# EasyEDA Pro project 单相逆变离并网和整流拓扑.epro, board PCB2
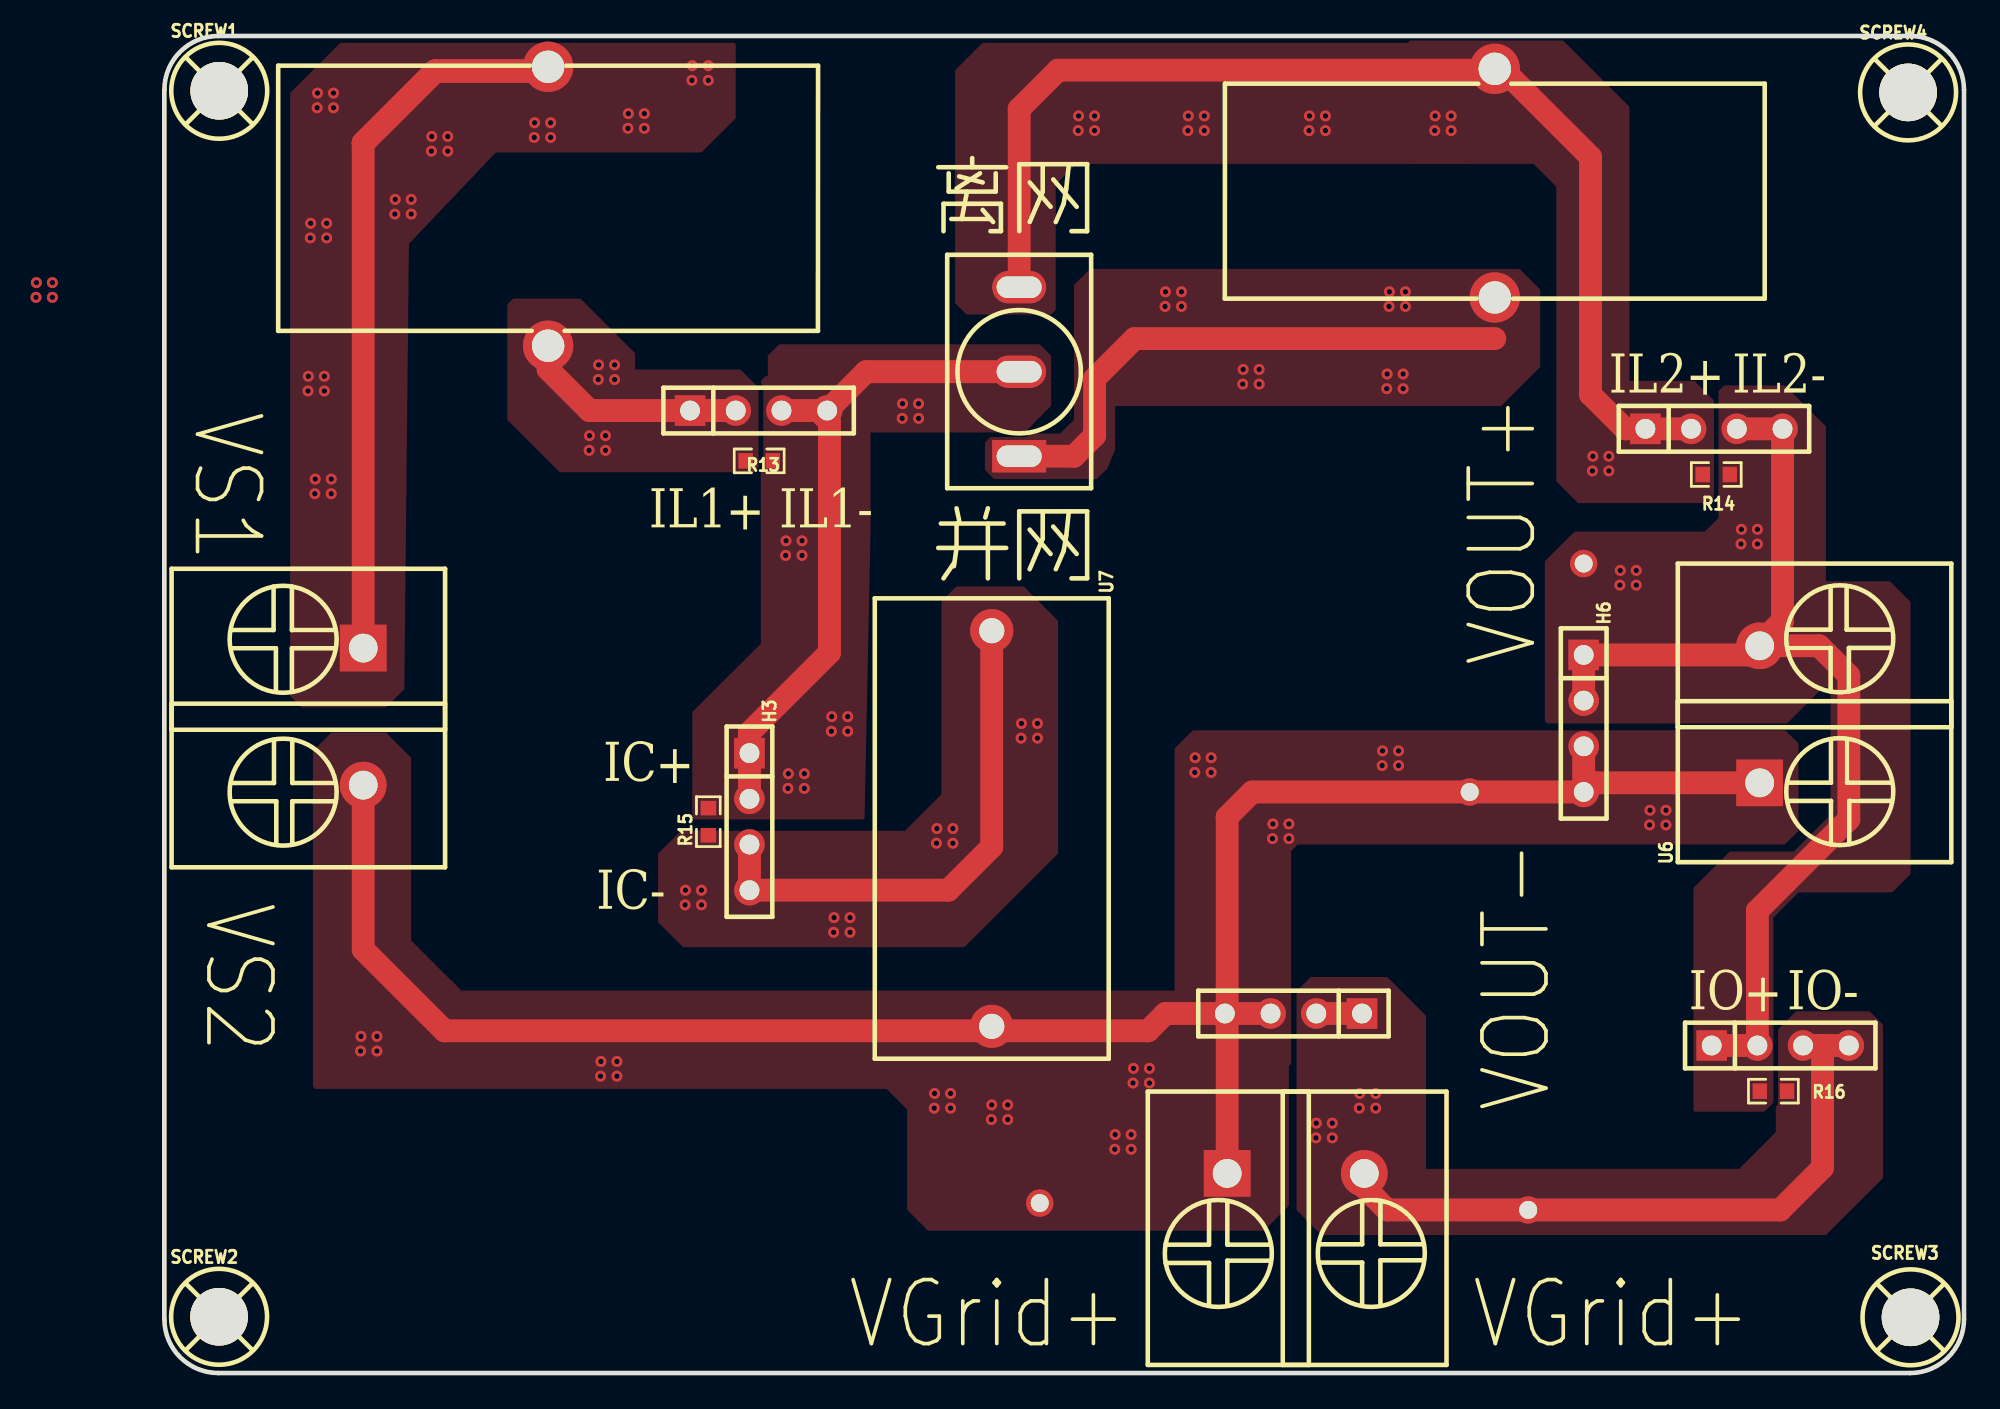
[diagram p2: board, top side]
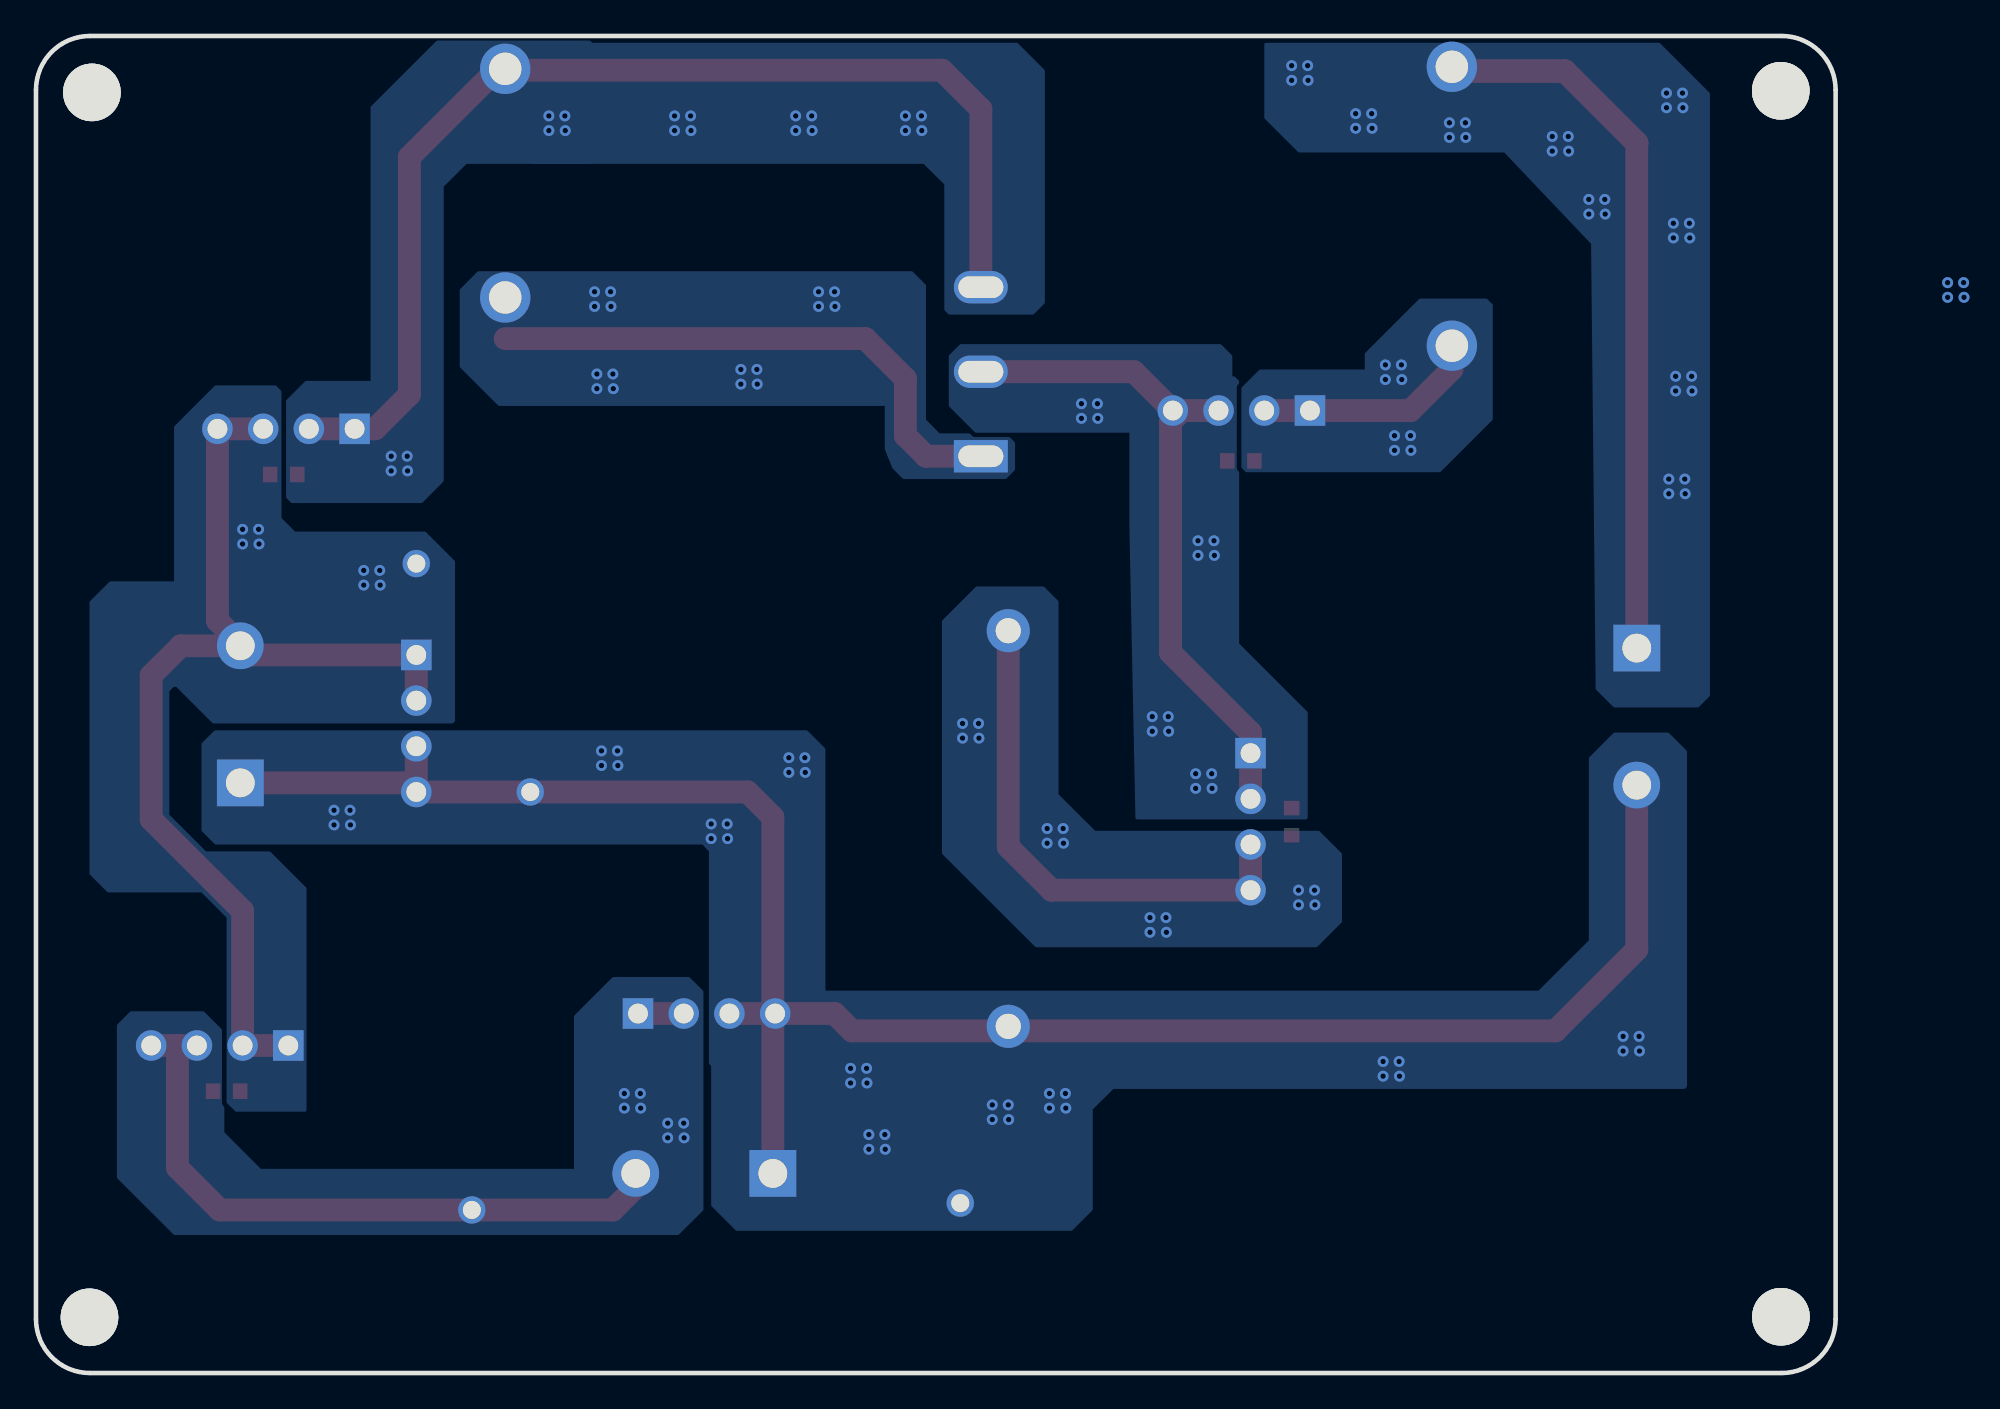
[diagram p3: board, bottom side, seen from below]

Outline 100 x 74.35 mm; copper layers: Top Layer, Bottom Layer. Coordinates in mm from the lower left corner of the outline.
Outline path: 0,71.35 0,3 arc(0.88,0.88) 3,0 97,0 arc(99.12,0.88) 100,3 100,71.35 arc(99.12,73.47) 97,74.35 3,74.35 arc(0.88,73.47) 0,71.35
Stack: Top Layer 0.035mm / Dielectric1 1.51mm FR4 er 4.5 / Bottom Layer 0.035mm

## Design rules (mm)
template: 自定义配置
spacing copperThickness1oz (default): track to track 0.102, other pairs 0.152 to 0.3
spacing copperThickness2oz: track to track 0.203, other pairs 0.152 to 0.3
track width copperThickness1oz (default): min 0.127, default 0.254, max 2.54
track width copperThickness2oz: min 0.203, default 0.254, max 2.54
differential pair differentialPair (default): width min 0.127, default 0.254, max 2.54; gap min 0.152, default 0.152
via viaSize (default): diameter min 0.5, default 0.61, max 10; hole min 0.3, default 0.305, max 6.3

## Placement (name value [footprint] x y rotation side)
H2  逆变侧电流检测  [HDR-TH_4P-P2.54-V-F]  33.02 53.52 0 top
H3  电容电流检测  [HDR-TH_4P-P2.54-V-F]  32.51 30.66 270 top
H4  网侧电流检测  [HDR-TH_4P-P2.54-V-F]  86.11 52.5 0 top
H5  继电器  [HDR-TH_4P-P2.54-V-F]  89.79 18.21 0 top
H6  逆变电压检测  [HDR-TH_4P-P2.54-V-F]  78.87 36.12 270 top
H7  电网电压检测  [HDR-TH_4P-P2.54-V-F]  62.74 19.99 180 top
L1  1.2mH  [直插环形电感]  23.37 65.58 270 top
L2  1.2mH  [直插环形电感#2]  71.88 64.06 90 top
NOREF  -  [Pad_e97]  75.78 9.07 0 top
NOREF#2  -  [Pad_e85]  78.87 45.01 0 top
NOREF#3  -  [Pad_e104]  48.64 9.45 0 top
NOREF#4  -  [Pad_e87]  72.53 32.31 0 top
R13  10Ω  [R0603]  33.05 50.72 0 top
R14  10Ω  [R0603]  86.23 49.96 0 top
R15  10Ω  [R0603]  30.23 30.66 90 top
R16  10Ω  [R0603]  89.41 15.67 0 top
SCREW1  -  [M3螺丝]  3.05 71.3 0 top
SCREW2  -  [M3螺丝]  3.04 3.13 0 top
SCREW3  -  [M3螺丝]  97.03 3.1 0 top
SCREW4  -  [M3螺丝]  96.89 71.21 0 top
U5  桥臂输出  [CONN-TH_2P-P7.62_L15.2-W16.7-EX4.2]  11.05 36.5 270 top
U6  桥臂输出  [CONN-TH_2P-P7.62_L15.2-W16.7-EX4.2]  88.65 36.63 90 top
U7  10uF  [CAP-TH_L25.5-W13.0-P22.50-D1.4]  45.97 30.28 270 top
U9  MT-0-102-A101-M200-RS  [SW-TH_MT-0-103-A101-M200-RS]  47.5 55.68 90 top
U10  桥臂输出  [CONN-TH_2P-P7.62_L15.2-W16.7-EX4.2]  62.86 11.1 0 top

## Footprints (pads in the part's own frame, mm; a bottom-side part is the same pattern mirrored in y, then rotated)
CAP-TH_L25.5-W13.0-P22.50-D1.4
  round 2.4 hole 1.4: 1(-11,0) 2(11,0)
CONN-TH_2P-P7.62_L15.2-W16.7-EX4.2
  rect 2.6x2.6 hole 1.6: 1(-3.81,0)
  round 2.6 hole 1.6: 2(3.81,0)
HDR-TH_4P-P2.54-V-F
  rect 1.7x1.7 hole 1.1: 1(-3.81,0)
  round 1.7 hole 1.1: 2(-1.27,0) 3(1.27,0) 4(3.81,0)
M3螺丝
  round 3.2 hole 3.2: 1(0,0)
Pad_e85
  round 1.524 hole 1: 1(0,0)
Pad_e87
  round 1.524 hole 1: 1(0,0)
Pad_e97
  round 1.524 hole 1: 1(0,0)
Pad_e104
  round 1.524 hole 1: 2(0,0)
R0603
  rect 0.806x0.864 smd: 1(-0.753,0) 2(0.753,0)
SW-TH_MT-0-103-A101-M200-RS
  rect 1.8x3 hole 1.2x2.5: 1(-4.7,0)
  oval 1.8x3 hole 1.2x2.5: 2(0,0) 3(4.7,0)
直插环形电感
  round 2.8 hole 1.8: 1(-7.048,-2.045) 2(8.46,-2.045)
直插环形电感#2
  round 2.8 hole 1.8: 1(-4.254,-2.045) 2(8.46,-2.045)

## Nets
IC+: H2.3 H2.4 H3.1 H3.2 R13.2 R15.2 U9.2
IC-: H3.3 H3.4 R15.1 U7.1
IL1+: H2.1 H2.2 L1.2 R13.1
IL2+: H4.1 H4.2 L2.2 R14.1 U9.3
IL2-: H4.3 H4.4 H5.1 H5.2 H6.1 H6.2 NOREF#2.1 R14.2 R16.1 U6.2
V_GRID1: H5.3 H5.4 H7.1 H7.2 NOREF.1 R16.2 U10.2
VOUT_2: H6.3 H6.4 H7.3 H7.4 NOREF#3.2 NOREF#4.1 U5.2 U6.1 U7.2 U10.1
VS1: L1.1 U5.1
$1N1843: L2.1 U9.1

Pads without a net: SCREW1 1; SCREW2 1; SCREW3 1; SCREW4 1

## Via types
v1: diameter 0.61, hole 0.305, Top Layer to Bottom Layer, 172 vias

## Routing (per net, layer and track width the routed paths; a pad name or vN(x,y) marks a point on that pad's centre or on a via; arc(x,y) is an arc through that point)
(no net):
  vias: v1(-7.13,59.81) v1(-7.11,60.63) v1(-6.22,60.63) v1(-6.22,59.81)
IC+: length 37.4
  Top Layer w1.27: 36.58,53.26 36.96,52.88 36.96,40.06 32.51,35.61 H3.1 H3.2 ; H2.3 H2.4 38.99,55.68 U9.2
  vias: v1(34.54,46.28) v1(34.52,45.46) v1(34.67,33.33) v1(34.65,32.51) v1(35.43,46.28) v1(35.43,45.46) v1(35.56,33.33) v1(35.56,32.51) v1(37.06,35.68) v1(37.08,36.5) v1(37.97,36.5) v1(37.97,35.68) v1(41.02,53.9) v1(41,53.08) v1(41.91,53.9) v1(41.91,53.08)
IC-: length 29.3
  Top Layer w1.27: H3.3 H3.4 43.56,26.85 45.97,29.26 45.97,41.53
  vias: v1(28.96,26.85) v1(28.93,26.03) v1(29.84,26.85) v1(29.84,26.03) v1(37.21,25.32) v1(37.19,24.51) v1(38.1,25.32) v1(38.1,24.51) v1(42.93,30.28) v1(42.9,29.46) v1(43.81,30.28) v1(43.81,29.46) v1(47.62,36.12) v1(47.6,35.3) v1(48.51,36.12) v1(48.51,35.3)
IL1+: length 12.9
  Top Layer w1.27: 21.32,57.38 21.32,55.82 23.62,53.52 H2.1 H2.2
  vias: v1(23.62,52.12) v1(23.6,51.31) v1(24.13,56.06) v1(24.11,55.24) v1(24.51,52.12) v1(24.51,51.31) v1(25.02,56.06) v1(25.02,55.24)
IL2+: length 64.2
  Top Layer w1.27: U9.3 47.5,70.28 49.66,72.44 73.85,72.44 L2.2 74.34,72.52 79.25,67.62 79.25,54.41 81.15,52.5 H4.1 H4.2
  vias: v1(50.8,69.9) v1(50.78,69.09) v1(51.69,69.9) v1(51.69,69.09) v1(56.87,69.09) v1(56.9,69.9) v1(57.78,69.9) v1(57.78,69.09) v1(63.63,69.9) v1(63.61,69.09) v1(64.52,69.9) v1(64.52,69.09) v1(70.61,69.9) v1(70.59,69.09) v1(71.5,69.9) v1(71.5,69.09) v1(79.37,50.98) v1(79.35,50.16) v1(80.26,50.98) v1(80.26,50.16)
IL2-: length 58.4
  Top Layer w1.27: H5.1 H5.2 88.52,25.7 93.6,30.78 93.6,38.79 91.95,40.44 U6.2 ; 87.38,52.5 89.92,52.5 89.92,41.83 88.01,39.93 H6.1 H6.2
  vias: v1(80.9,44.63) v1(80.88,43.81) v1(81.79,44.63) v1(81.79,43.81) v1(87.63,46.91) v1(87.61,46.1) v1(88.52,46.91) v1(88.52,46.1)
V_GRID1: length 39.6
  Top Layer w1.27: 92.14,18.21 92.14,11.42 89.79,9.07 NOREF.1 67.95,9.07 66.67,10.34 U10.2 ; 92.14,18.21 H5.4 ; 92.14,18.21 H5.3 ; H7.2 H7.1
  vias: v1(64.01,13.89) v1(63.99,13.08) v1(64.9,13.89) v1(64.9,13.08) v1(66.42,15.55) v1(66.4,14.73) v1(67.31,15.55) v1(67.31,14.73)
VOUT_2: length 114.7
  Top Layer w1.27: 59.05,19.99 59.05,30.91 60.45,32.31 NOREF#4.1 H6.4 ; 59.05,19.99 H7.3 ; 59.05,19.99 H7.4 ; 59.05,19.99 59.05,19.86 ; H6.4 79.37,32.82 U6.1 ; H6.4 H6.3 ; U5.2 11.05,23.55 15.57,19.03 54.66,19.03 55.63,19.99 H7.4 ; H7.4 59.05,19.86 ; U10.1 59.05,19.86
  vias: v1(10.92,18.72) v1(10.9,17.9) v1(11.81,18.72) v1(11.81,17.9) v1(24.26,17.32) v1(24.23,16.51) v1(25.15,17.32) v1(25.15,16.51) v1(42.8,15.55) v1(42.78,14.73) v1(43.69,15.55) v1(43.69,14.73) v1(45.97,14.91) v1(45.95,14.09) v1(46.86,14.91) v1(46.86,14.09) v1(52.83,13.26) v1(52.81,12.44) v1(53.72,13.26) v1(53.72,12.44) v1(53.85,16.94) v1(53.83,16.13) v1(54.74,16.94) v1(54.74,16.13) v1(57.25,33.4) v1(57.28,34.21) v1(58.17,34.21) v1(58.17,33.4) v1(61.57,29.72) v1(61.59,30.53) v1(62.48,30.53) v1(62.48,29.72) v1(67.67,33.78) v1(67.69,34.59) v1(68.58,34.59) v1(68.58,33.78) v1(82.55,31.29) v1(82.53,30.48) v1(83.44,31.29) v1(83.44,30.48)
VS1: length 63.9
  Top Layer w1.27: 11.05,68.39 15.05,72.39 21.32,72.39 ; 11.05,68.39 11.05,68.41 15.05,72.41 21.32,72.41 ; 11.05,68.39 11.05,68.38 ; 11.05,68.38 U5.1 ; 11.05,68.38 15.05,72.38 21.32,72.38
  vias: v1(8,55.42) v1(7.98,54.61) v1(8.13,63.93) v1(8.11,63.12) v1(8.36,48.89) v1(8.38,49.71) v1(8.51,71.17) v1(8.49,70.36) v1(8.89,55.42) v1(8.89,54.61) v1(9.02,63.93) v1(9.02,63.12) v1(9.27,49.71) v1(9.27,48.89) v1(9.4,71.17) v1(9.4,70.36) v1(12.83,65.26) v1(12.8,64.44) v1(13.72,65.26) v1(13.72,64.44) v1(14.86,68.76) v1(14.84,67.94) v1(15.75,68.76) v1(15.75,67.94) v1(20.57,69.52) v1(20.55,68.7) v1(21.46,69.52) v1(21.46,68.7) v1(25.76,69.21) v1(25.78,70.03) v1(26.67,70.03) v1(26.67,69.21) v1(29.34,72.7) v1(29.31,71.88) v1(30.23,72.7) v1(30.23,71.88)
$1N1843: length 31
  Top Layer w1.27: U9.1 50.55,50.98 51.69,52.12 51.69,55.3 53.91,57.52 73.93,57.52
  vias: v1(55.63,60.12) v1(55.6,59.31) v1(56.52,60.12) v1(56.52,59.31) v1(59.94,55.8) v1(59.92,54.99) v1(60.83,55.8) v1(60.83,54.99) v1(67.95,55.55) v1(67.92,54.73) v1(68.07,60.12) v1(68.05,59.31) v1(68.83,55.55) v1(68.83,54.73) v1(68.96,60.12) v1(68.96,59.31)

## Copper pours and planes (outline as drawn; the poured copper is in the pictures)
IC+ on Top Layer: 33.53,52.3 47.8,52.3 49.28,53.77 49.28,56.57 48.64,57.2 34.16,57.2 33.53,56.57
IC+ on Top Layer: 29.34,30.78 38.9,30.78 39.24,47.06 39.24,54.92 38.73,55.42 33.4,55.42 33.15,55.17 33.15,40.56 29.34,36.75
IC+ on Bottom Layer: 33.53,52.3 47.8,52.3 49.28,53.77 49.28,56.57 48.64,57.2 34.16,57.2 33.53,56.57
IC+ on Bottom Layer: 33.53,52.3 47.8,52.3 49.28,53.77 49.28,56.57 48.64,57.2 34.16,57.2 33.53,56.57
IC+ on Bottom Layer: 29.34,30.78 38.9,30.78 39.24,47.06 39.24,54.92 38.73,55.42 33.4,55.42 33.15,55.17 33.15,40.56 29.34,36.75
IC+ on Bottom Layer: 33.53,52.3 47.8,52.3 49.28,53.77 49.28,56.57 48.64,57.2 34.16,57.2 33.53,56.57
IC- on Top Layer: 44,43.74 47.75,43.74 49.66,41.83 49.66,28.88 44.45,23.67 28.83,23.67 27.43,25.07 27.43,28.88 28.7,30.15 41.15,30.15 43.18,32.18 43.18,42.92
IC- on Bottom Layer: 44,43.74 47.75,43.74 49.66,41.83 49.66,28.88 44.45,23.67 28.83,23.67 27.43,25.07 27.43,28.88 28.7,30.15 41.15,30.15 43.18,32.18 43.18,42.92
IL1+ on Top Layer: 19.38,59.74 23.12,59.74 26.16,56.7 26.16,55.8 32,55.8 33.02,54.79 33.02,50.34 32.77,50.09 21.97,50.09 19.05,53.01 19.05,59.41
IL1+ on Bottom Layer: 19.38,59.74 23.12,59.74 26.16,56.7 26.16,55.8 32,55.8 33.02,54.79 33.02,50.34 32.77,50.09 21.97,50.09 19.05,53.01 19.05,59.41
IL2+ on Top Layer: 71.5,73.97 45.47,73.97 43.94,72.44 43.94,59.49 44.58,58.85 49.28,58.85 49.53,59.11 49.53,66.09 50.67,67.23 72.39,67.23 72.52,67.36 72.52,72.95
IL2+ on Top Layer: 68.71,73.58 69.21,74.09 77.72,74.09 81.41,70.41 81.41,55.17 85.02,55.17 86.11,54.08 86.11,48.67 85.81,48.37 78.55,48.37 77.34,49.58 77.34,65.96 76.07,67.23 69.21,67.23 68.71,67.74
IL2+ on Bottom Layer: 71.5,73.97 45.47,73.97 43.94,72.44 43.94,59.49 44.58,58.85 49.28,58.85 49.53,59.11 49.53,66.09 50.67,67.23 72.39,67.23 72.52,67.36 72.52,72.95
IL2+ on Bottom Layer: 68.71,73.58 69.21,74.09 77.72,74.09 81.41,70.41 81.41,55.17 85.02,55.17 86.11,54.08 86.11,48.67 85.81,48.37 78.55,48.37 77.34,49.58 77.34,65.96 76.07,67.23 69.21,67.23 68.71,67.74
IL2- on Top Layer: 84.96,14.53 88.9,14.53 89.41,15.03 89.41,25.32 90.8,26.72 96.01,26.72 97.03,27.74 97.03,42.89 95.89,44.02 87.53,44.02 86.36,42.85 86.36,38.66 86.87,38.15 92.34,38.15 92.59,37.91 92.59,31.04 90.55,29.01 86.99,29.01 84.96,26.98
IL2- on Top Layer: 86.67,54.92 90.04,54.92 92.33,52.63 92.33,38.28 90.17,36.12 76.83,36.12 76.71,36.25 76.71,45.14 78.36,46.79 85.6,46.79 86.36,47.55 86.36,54.6
IL2- on Bottom Layer: 84.96,14.53 88.9,14.53 89.41,15.03 89.41,25.32 90.8,26.72 96.01,26.72 97.03,27.74 97.03,42.89 95.89,44.02 87.53,44.02 86.36,42.85 86.36,38.66 86.87,38.15 92.34,38.15 92.59,37.91 92.59,31.04 90.55,29.01 86.99,29.01 84.96,26.98
IL2- on Bottom Layer: 86.67,54.92 90.04,54.92 92.33,52.63 92.33,38.28 90.17,36.12 76.83,36.12 76.71,36.25 76.71,45.14 78.36,46.79 85.6,46.79 86.36,47.55 86.36,54.6
V_GRID1 on Top Layer: 63.7,22.02 67.95,22.02 70.1,19.86 70.1,11.35 87.5,11.35 89.53,13.39 89.53,18.97 90.68,20.12 94.74,20.12 95.5,19.36 95.5,10.85 92.33,7.67 64.3,7.67 62.91,9.06 62.91,21.24
V_GRID1 on Bottom Layer: 63.7,22.02 67.95,22.02 70.1,19.86 70.1,11.35 87.5,11.35 89.53,13.39 89.53,18.97 90.68,20.12 94.74,20.12 95.5,19.36 95.5,10.85 92.33,7.67 64.3,7.67 62.91,9.06 62.91,21.24
VOUT_2 on Top Layer: 12.32,35.61 13.72,34.21 13.72,24.05 16.51,21.26 62.48,21.26 62.48,9.3 61.09,7.91 42.44,7.91 41.27,9.07 41.27,14.66 40.13,15.8 8.38,15.8 8.25,15.93 8.25,34.58 9.28,35.61
VOUT_2 on Top Layer: 90.07,35.74 57.15,35.74 56.13,34.72 56.13,17.2 56.64,16.69 62.1,16.69 62.61,17.2 62.61,29.01 62.97,29.39 90.04,29.39 90.8,30.15 90.8,35.01
VOUT_2 on Bottom Layer: 90.07,35.74 57.15,35.74 56.13,34.72 56.13,17.2 56.64,16.69 62.1,16.69 62.61,17.2 62.61,29.01 62.97,29.39 90.04,29.39 90.8,30.15 90.8,35.01
VOUT_2 on Bottom Layer: 12.32,35.61 13.72,34.21 13.72,24.05 16.51,21.26 62.48,21.26 62.48,9.3 61.09,7.91 42.44,7.91 41.27,9.07 41.27,14.66 40.13,15.8 8.38,15.8 8.25,15.93 8.25,34.58 9.28,35.61
VS1 on Top Layer: 7.62,37.01 12.32,37.01 13.33,38.02 13.59,62.79 18.41,67.87 29.84,67.87 31.75,69.77 31.75,73.97 9.78,73.97 6.98,71.17 6.98,37.65
VS1 on Bottom Layer: 7.62,37.01 12.32,37.01 13.33,38.02 13.59,62.79 18.41,67.87 29.84,67.87 31.75,69.77 31.75,73.97 9.78,73.97 6.98,71.17 6.98,37.65
$1N1843 on Top Layer: 46.1,49.71 51.81,49.71 52.41,50.3 52.83,51.36 52.83,53.77 74.3,53.77 76.45,55.93 76.45,60.25 75.31,61.39 51.43,61.39 50.55,60.5 50.55,53.01 49.78,52.25 46.1,52.25 45.59,51.74 45.59,50.22
$1N1843 on Bottom Layer: 46.1,49.71 51.81,49.71 52.41,50.3 52.83,51.36 52.83,53.77 74.3,53.77 76.45,55.93 76.45,60.25 75.44,61.27 51.31,61.27 50.55,60.5 50.55,53.01 49.78,52.25 46.1,52.25 45.59,51.74 45.59,50.22

Small or netless copper shapes (teardrops, artwork), in the pictures only: 58 on Top Layer

## Text on the board
Top Silkscreen Layer: VS1 | VS2 | VOUT+ | VOUT- | VGrid+ | IC- | IC+ | IL1+ | IL1- | IL2+ | IO+ | IL2- | IO- | 离网 | 并网
